# Altium schematic sheet tailSensors.SchDoc
size A4
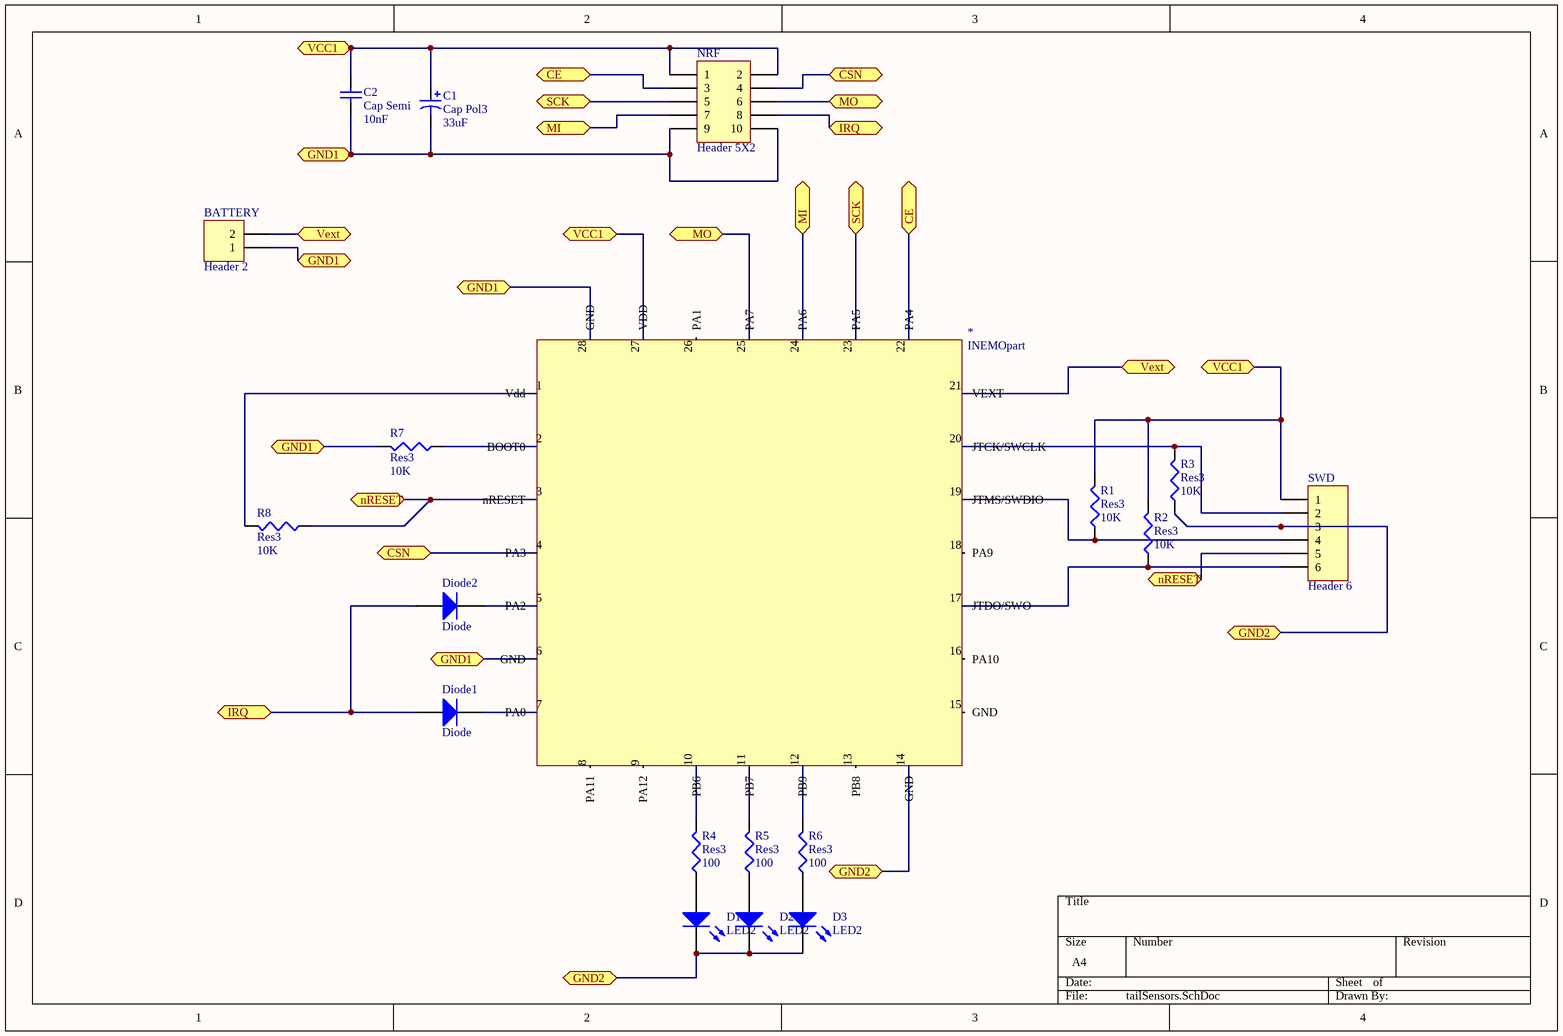
[diagram p0: tailSensors.SchDoc]

## Parts
*  INEMOpart  [INEMO - duplicate3]
BATTERY  Header 2  [HDR1X2]
C1  Cap Pol3  value 33uF  [C0805]
C2  Cap Semi  value 10nF  [C1206]
D1  LED2  [3.2X1.6X1.1]
D2  LED2  [3.2X1.6X1.1]
D3  LED2  [3.2X1.6X1.1]
Diode1  Diode  [J1-0603]
Diode2  Diode  [J1-0603]
NRF  Header 5X2  [HDR2X5]
R1  Res3  value 10K  [J1-0603]
R2  Res3  value 10K  [J1-0603]
R3  Res3  value 10K  [J1-0603]
R4  Res3  value 100  [J1-0603]
R5  Res3  value 100  [J1-0603]
R6  Res3  value 100  [J1-0603]
R7  Res3  value 10K  [J1-0603]
R8  Res3  value 10K  [J1-0603]
SWD  Header 6  [HDR1X6]

## Ports
CE, CSN, GND1, GND2, IRQ, MI, MO, nRESET, SCK, VCC1, Vext

## Nets
CE: *.22(PA4) NRF.3 ; port CE
CSN: *.4(PA3) NRF.4 ; port CSN
GND1: *.6(GND) *.28(GND) BATTERY.1 C1.2 C2.1 NRF.9 NRF.10 R7.2 ; port GND1
GND2: *.14(GND) D1.2(K) D2.2(K) D3.2(K) R3.1 SWD.3 ; port GND2
IRQ: Diode1.1(A) Diode2.1(A) NRF.8 ; port IRQ
MI: *.24(PA6) NRF.7 ; port MI
MO: *.25(PA7) NRF.6 ; port MO
nRESET: *.3(nRESET) R8.1 SWD.5 ; port nRESET
SCK: *.23(PA5) NRF.5 ; port SCK
VCC1: *.27(VDD) C1.1 C2.2 NRF.1 NRF.2 R1.2 R2.2 SWD.1 ; port VCC1
Vext: *.21(VEXT) BATTERY.2 ; port Vext
Net*_1: *.1(Vdd) R8.2
Net*_2: *.2(BOOT0) R7.1
Net*_5: *.5(PA2) Diode2.2(K)
Net*_7: *.7(PA0) Diode1.2(K)
Net*_10: *.10(PB6) R4.2
Net*_11: *.11(PB7) R5.2
Net*_12: *.12(PB9) R6.2
Net*_17: *.17(JTDO/SWO) R2.1 SWD.6
Net*_19: *.19(JTMS/SWDIO) R1.1 SWD.4
Net*_20: *.20(JTCK/SWCLK) R3.2 SWD.2
NetD1_1: D1.1(A) R4.1
NetD2_1: D2.1(A) R5.1
NetD3_1: D3.1(A) R6.1

Not connected (* = marked no-connect by the designer): * 8(PA11) 9(PA12) 13(PB8) 15(GND) 16(PA10) 18(PA9) 26(PA1)

## Library data of the parts
* = Component_1
BATTERY = Header 2: Header, 2-Pin; LatestRevisionDate: 17-Jul-2002; LatestRevisionNote: Re-released for DXP Platform.; Publisher: Altium Limited
C1 = Cap Pol3: Polarized Capacitor (Surface Mount); Published: 8-Jun-2000; LatestRevisionDate: 29-May-2009; LatestRevisionNote: IPC-7351 Footprint Added.; PackageReference: C0805; Publisher: Altium Limited; PackageDescription: Chip Capacitor
C2 = Cap Semi: Capacitor (Semiconductor SIM Model); Published: 8-Jun-2000; LatestRevisionDate: 29-May-2009; LatestRevisionNote: IPC-7351 Footprint Added.; PackageReference: C1206; Publisher: Altium Limited; PackageDescription: Chip Capacitor
D1-D3 = LED2: Typical RED, GREEN, YELLOW, AMBER GaAs LED; Published: 8-Jun-2000; LatestRevisionDate: 17-Jul-2002; LatestRevisionNote: Re-released for DXP Platform.; PackageVersion: Feb-2002; PackageReference: 3.2X1.6X1.1; Publisher: Altium Limited; PackageDescription: SM LED; 2 Flat Leads
Diode1 Diode2 = Diode: Default Diode; Published: 8-Jun-2000; LatestRevisionDate: 17-Jul-2002; LatestRevisionNote: Re-released for DXP Platform.; PackageVersion: Sep-1996; PackageReference: SMC; Publisher: Altium Limited; PackageDescription: DO-214-AB/SMC; 2 C-Bend Leads; Body 7.9 x 5.9 mm, inc. leads (LxW); Code_JEDEC: DO-214-AB
NRF = Header 5X2: Header, 5-Pin, Dual row; LatestRevisionDate: 17-Jul-2002; LatestRevisionNote: Re-released for DXP Platform.; Publisher: Altium Limited
R1-R8 = Res3: Resistor; Published: 8-Jun-2000; LatestRevisionDate: 29-May-2009; LatestRevisionNote: IPC-7351 Footprint Added.; PackageReference: J1-0603; Publisher: Altium Limited; PackageDescription: Chip Resistor
SWD = Header 6: Header, 6-Pin; LatestRevisionDate: 17-Jul-2002; LatestRevisionNote: Re-released for DXP Platform.; Publisher: Altium Limited